# Altium project BATT_ctrl_v2.2.PrjPcb
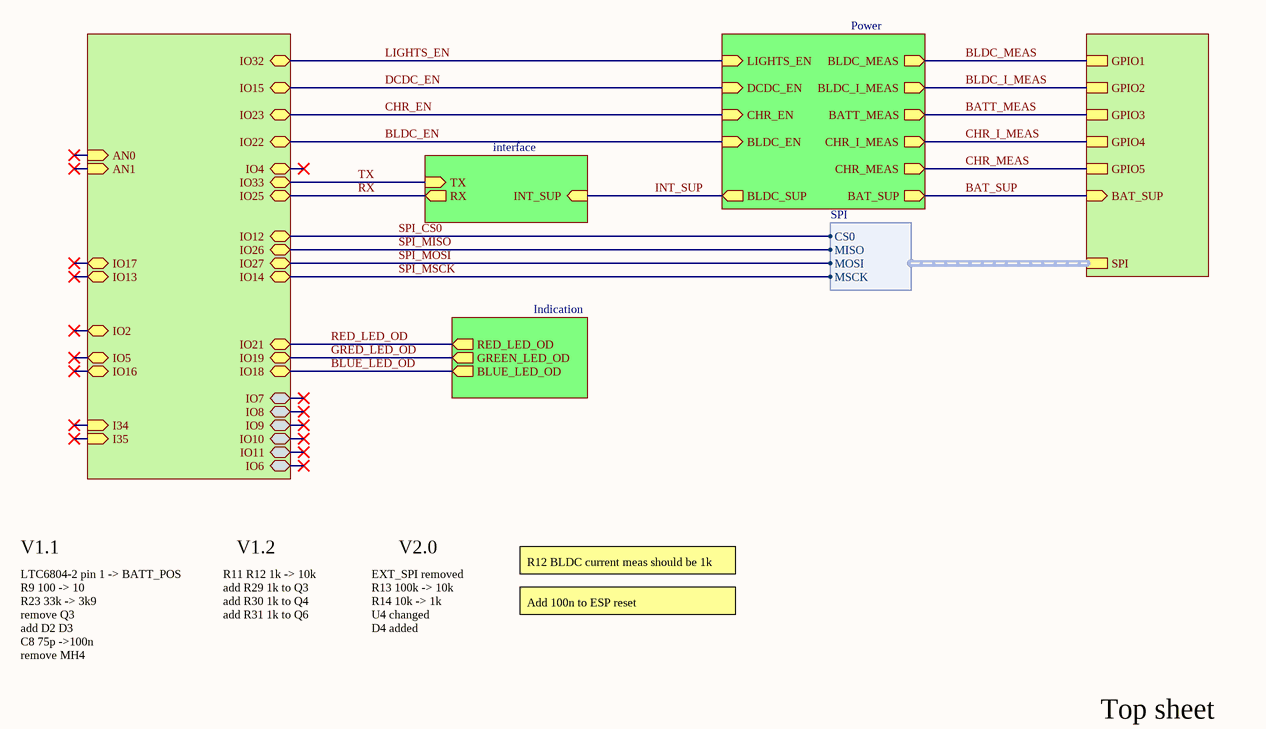
[diagram p0: top_sheet.SchDoc]
2 sheets, 4 parts. Net scope: hierarchical (ports join the sheet entries above them; power ports are global).
Board file: batt_ctrl_pcb_v2.2.PcbDoc
Sheets:
  top_sheet.SchDoc
    Indication = indication.SchDoc

## Sheet top_sheet.SchDoc
size A4; SheetNumber: 1; SheetTotal: 7

### Sub-sheets
Indication = indication.SchDoc: RED_LED_OD (out), GREEN_LED_OD (out), BLUE_LED_OD (out)
interface = data_interface.SchDoc (file not in this document): TX (in), RX (out), INT_SUP (in)
Power = power.SchDoc (file not in this document): BLDC_EN (in), BLDC_I_MEAS (out), CHR_EN (in), CHR_I_MEAS (out), BLDC_MEAS (out), CHR_MEAS (out), BATT_MEAS (out), BAT_SUP (out), DCDC_EN (in), BLDC_SUP (out), LIGHTS_EN (in)
U_ESP32_WROOM2 = ESP32_WROOM2 (file not in this document): IO25 (bidir), IO26 (bidir), IO27 (bidir), IO22 (bidir), IO23 (bidir), IO32 (bidir), IO19 (bidir), IO21 (bidir), IO33 (bidir), IO14 (bidir), IO12 (bidir), IO15 (bidir), IO16 (bidir), IO17 (bidir), IO18 (bidir), IO13 (bidir), I34 (in), I35 (in), IO5 (bidir), IO4 (bidir), IO2 (bidir), AN0 (in), AN1 (in), IO7 (bidir), IO8 (bidir), IO9 (bidir), IO10 (bidir), IO11 (bidir), IO6 (bidir)
U_LTC6804-2_BMS_TR = LTC6804-2_BMS_TR (file not in this document): SPI (harness SPI), GPIO1, GPIO2, GPIO3, GPIO4, GPIO5, BAT_SUP (in)

### Harnesses
SPI: CS0, MISO, MOSI, MSCK

### Nets
BAT_SUP: sheet Power/BAT_SUP, sheet U_LTC6804-2_BMS_TR/BAT_SUP
BATT_MEAS: sheet Power/BATT_MEAS, sheet U_LTC6804-2_BMS_TR/GPIO3
BLDC_EN: sheet U_ESP32_WROOM2/IO22, sheet Power/BLDC_EN
BLDC_I_MEAS: sheet Power/BLDC_I_MEAS, sheet U_LTC6804-2_BMS_TR/GPIO2
BLDC_MEAS: sheet Power/BLDC_MEAS, sheet U_LTC6804-2_BMS_TR/GPIO1
BLUE_LED_OD: sheet U_ESP32_WROOM2/IO18, sheet Indication/BLUE_LED_OD
CHR_EN: sheet U_ESP32_WROOM2/IO23, sheet Power/CHR_EN
CHR_I_MEAS: sheet Power/CHR_I_MEAS, sheet U_LTC6804-2_BMS_TR/GPIO4
CHR_MEAS: sheet Power/CHR_MEAS, sheet U_LTC6804-2_BMS_TR/GPIO5
DCDC_EN: sheet U_ESP32_WROOM2/IO15, sheet Power/DCDC_EN
GRED_LED_OD: sheet U_ESP32_WROOM2/IO19, sheet Indication/GREEN_LED_OD
INT_SUP: sheet Power/BLDC_SUP, sheet interface/INT_SUP
LIGHTS_EN: sheet U_ESP32_WROOM2/IO32, sheet Power/LIGHTS_EN
RED_LED_OD: sheet U_ESP32_WROOM2/IO21, sheet Indication/RED_LED_OD
RX: sheet U_ESP32_WROOM2/IO25, sheet interface/RX
SPI_CS0: sheet U_ESP32_WROOM2/IO12, sheet U_LTC6804-2_BMS_TR/SPI.CS0
SPI_MISO: sheet U_ESP32_WROOM2/IO26, sheet U_LTC6804-2_BMS_TR/SPI.MISO
SPI_MOSI: sheet U_ESP32_WROOM2/IO27, sheet U_LTC6804-2_BMS_TR/SPI.MOSI
SPI_MSCK: sheet U_ESP32_WROOM2/IO14, sheet U_LTC6804-2_BMS_TR/SPI.MSCK
TX: sheet U_ESP32_WROOM2/IO33, sheet interface/TX

### Notes on the sheet
- V1.1
- LTC6804-2 pin 1 -> BATT_POS
- R11 R12 1k -> 10k
- V1.2
- EXT_SPI removed
- V2.0
- R12 BLDC current meas should be 1k
- R9 100 -> 10
- R23 33k -> 3k9
- remove Q3
- add D2 D3
- C8 75p ->100n
- add R29 1k to Q3
- add R30 1k to Q4
- add R31 1k to Q6
- R13 100k -> 10k
- R14 10k -> 1k
- U4 changed
- D4 added
- Add 100n to ESP reset
- remove MH4
- Top sheet

## Sheet indication.SchDoc
size A4; SheetNumber: 4; SheetTotal: 7
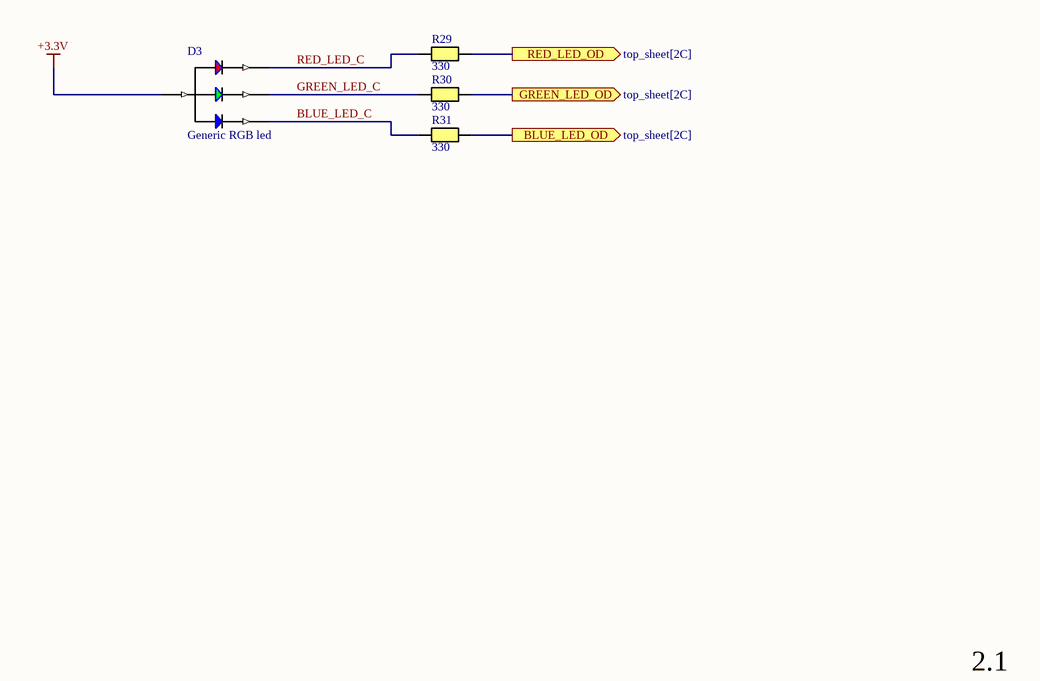
[diagram p1: indication.SchDoc]

### Parts
D3  Generic RGB led  [RGB throu hole 90 deg]
R29  330  [RESC0603(1608)_N]
R30  330  [RESC0603(1608)_N]
R31  330  [RESC0603(1608)_N]

### Ports
BLUE_LED_OD (out, see top_sheet[2C]), GREEN_LED_OD (out, see top_sheet[2C]), RED_LED_OD (out, see top_sheet[2C])

### Nets
+3.3V: D3.CA
BLUE_LED_C: D3.BC R31.1
BLUE_LED_OD: R31.2 ; port BLUE_LED_OD
GRED_LED_OD: R30.2 ; port GREEN_LED_OD
GREEN_LED_C: D3.GC R30.1
RED_LED_C: D3.RC R29.1
RED_LED_OD: R29.2 ; port RED_LED_OD

### Notes on the sheet
- 2.1

### Library data of the parts
D3 = RGB led
R29-R31 = Resistor M: Resistor Medium Density; Value: 330